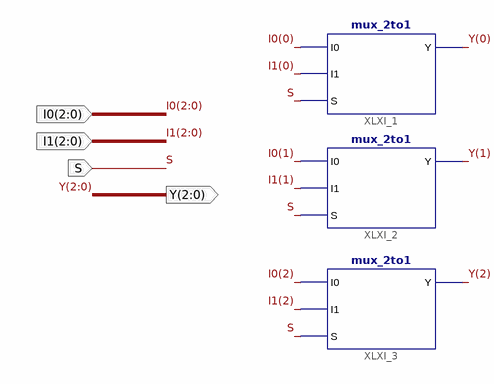
[diagram p0: schematic sheet 1]
// Xilinx ISE schematic mux_3bit_2to1.sch (virtex6) as structural Verilog: 3 symbols, 4 ports
module mux_3bit_2to1 (
  input  S,
  input  [2:0] I0,
  input  [2:0] I1,
  output [2:0] Y
);

  mux_2to1 XLXI_1 (.I0(I0[0]), .I1(I1[0]), .S(S), .Y(Y[0]));
  mux_2to1 XLXI_2 (.I0(I0[1]), .I1(I1[1]), .S(S), .Y(Y[1]));
  mux_2to1 XLXI_3 (.I0(I0[2]), .I1(I1[2]), .S(S), .Y(Y[2]));
endmodule
